# Altium project X_Drive.PrjPcb
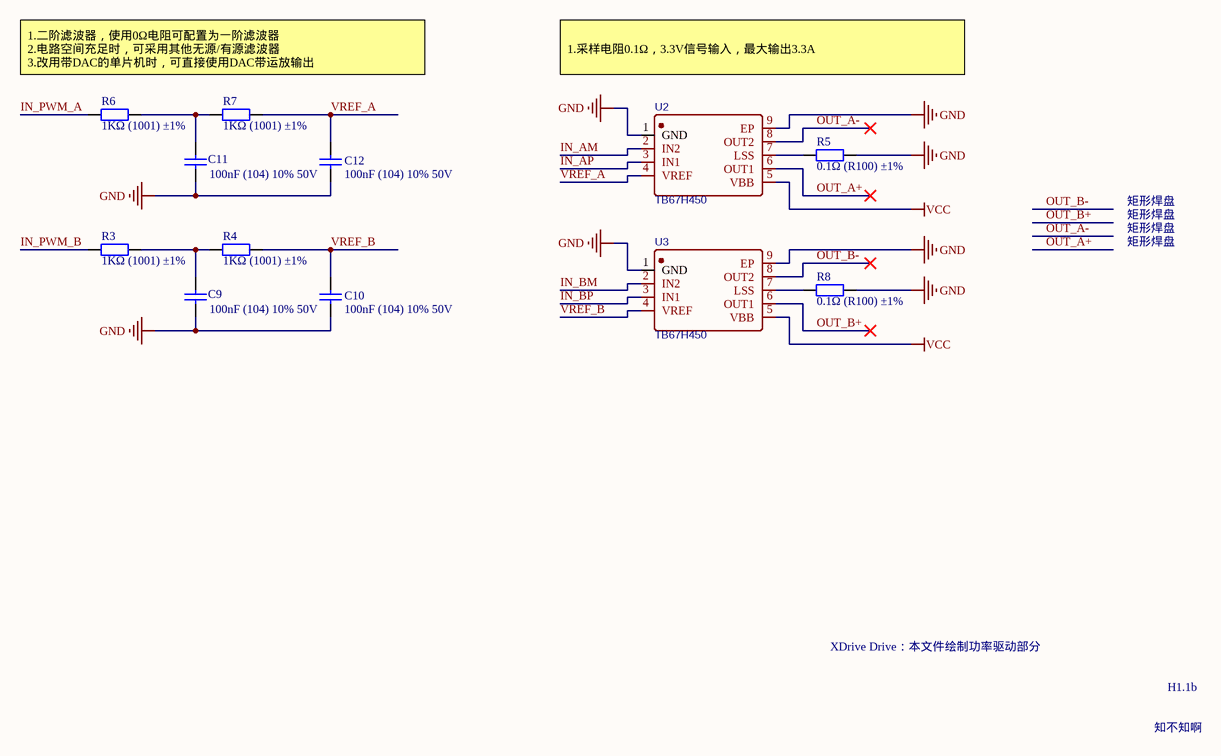
[diagram p0: Drive.SchDoc]
6 sheets, 102 parts. Net scope: global (net labels, ports and power ports of the same name join across sheets).
Board files: PCB.PcbDoc, PCB - 焊接图.PcbDoc
Sheets:
  Drive.SchDoc
  MCU.SchDoc
  Port.SchDoc
  Power.SchDoc
  Sensor.SchDoc
  UI.SchDoc

## Sheet Drive.SchDoc
size A4

### Parts
C9  100nF (104) 10% 50V  [0603_C]
C10  100nF (104) 10% 50V  [0603_C]
C11  100nF (104) 10% 50V  [0603_C]
C12  100nF (104) 10% 50V  [0603_C]
R3  1KΩ (1001) ±1%  [0603_R]
R4  1KΩ (1001) ±1%  [0603_R]
R5  0.1Ω (R100) ±1%  [1206_R]
R6  1KΩ (1001) ±1%  [0603_R]
R7  1KΩ (1001) ±1%  [0603_R]
R8  0.1Ω (R100) ±1%  [1206_R]
U2  TB67H450  [SOIC-8_EP_150MIL]
U3  TB67H450  [SOIC-8_EP_150MIL]

### Nets
GND: C9.1 C10.1 C11.1 C12.1 R5.2 R8.2 U2.1(GND) U2.9(EP) U3.1(GND) U3.9(EP)
VCC: U2.5(VBB) U3.5(VBB)
IN_AM: U2.2(IN2)
IN_AP: U2.3(IN1)
IN_BM: U3.2(IN2)
IN_BP: U3.3(IN1)
IN_PWM_A: R6.1
IN_PWM_B: R3.1
OUT_A+: U2.6(OUT1)
OUT_A-: U2.8(OUT2)
OUT_B+: U3.6(OUT1)
OUT_B-: U3.8(OUT2)
VREF_A: C12.2 R7.2 U2.4(VREF)
VREF_B: C10.2 R4.2 U3.4(VREF)
NetC9_2: C9.2 R3.2 R4.1
NetC11_2: C11.2 R6.2 R7.1
NetR5_1: R5.1 U2.7(LSS)
NetR8_1: R8.1 U3.7(LSS)

### Notes on the sheet
- 1.二阶滤波器，使用0Ω电阻可配置为一阶滤波器
  2.电路空间充足时，可采用其他无源/有源滤波器
  3.改用带DAC的单片机时，可直接使用DAC带运放输出
- 1.采样电阻0.1Ω，3.3V信号输入，最大输出3.3A
- 矩形焊盘
- XDrive Drive：本文件绘制功率驱动部分
- H1.1b
- 知不知啊

### Library data of the parts
C9-C12 = 0603 100nF (104) 10% 50V: 贴片电容; ComponentLink1Description: 供应商链接; ComponentLink1URL: http://www.szlcsc.com/product/details_15331.html; Package: 0603; Supplier: LC; SuppliersPartNumber: C14663
R3 R4 R6 R7 = 0603 1KΩ (1001) 1%: 贴片电阻; ComponentLink1Description: 供应商链接; ComponentLink1URL: http://www.szlcsc.com/product/details_21904.html; Package: 0603; Supplier: LC; SuppliersPartNumber: C21190
R5 R8 = 1206 0.1Ω (R100) 1%: 贴片电阻; ComponentLink1Description: 供应商链接; ComponentLink1URL: http://www.szlcsc.com/product/details_26077.html; Package: 1206; Supplier: LC; SuppliersPartNumber: C25334
U2 U3 = A4950ELJTR-T: 直流电机驱动器; BOM_Manufacturer: ALLEGRO; SMT Type: Extend; BOM_Supplier: LCSC; BOM_Manufacturer Part: A4950ELJTR-T; BOM_Supplier Part: C82404; BOM_LCSC Assembly: Yes; spicePre: U; spiceSymbolName: A4950ELJTR-T

## Sheet MCU.SchDoc
size A4
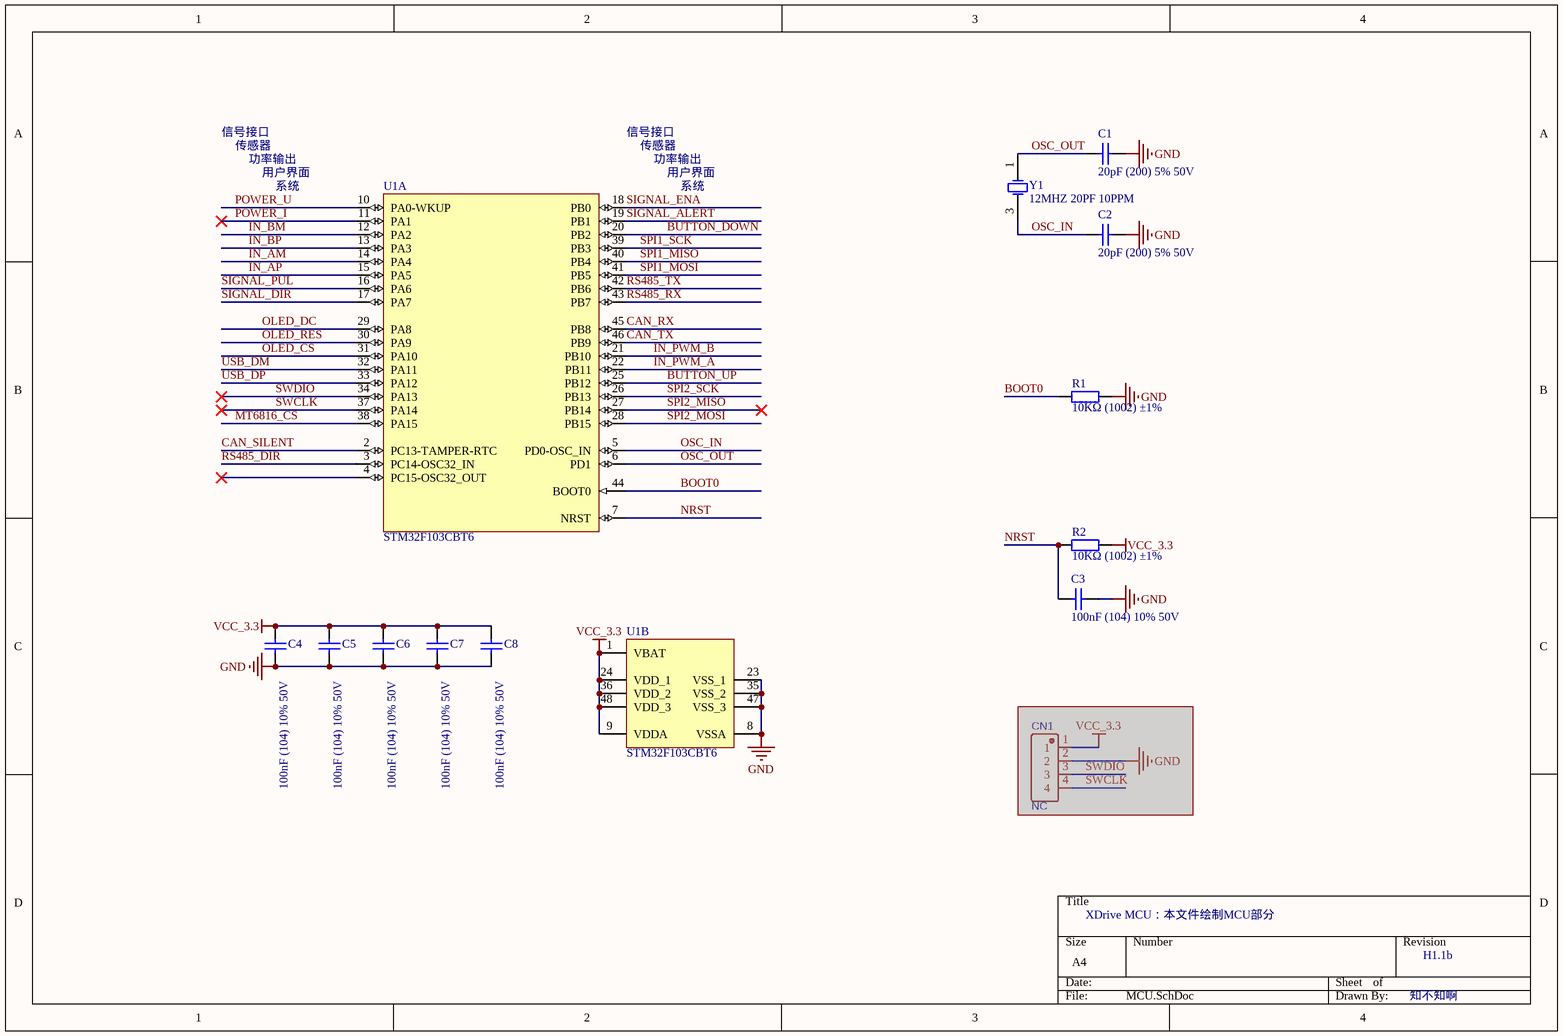
[diagram p1: MCU.SchDoc]

### Parts
(Parts that share a designator on the sheet are numbered #1, #2 ... from top to bottom, then left to right.)
C1  20pF (200) 5% 50V  [0603_C]
C2  20pF (200) 5% 50V  [0603_C]
C3  100nF (104) 10% 50V  [0603_C]
C4  100nF (104) 10% 50V  [0603_C]
C5  100nF (104) 10% 50V  [0603_C]
C6  100nF (104) 10% 50V  [0603_C]
C7  100nF (104) 10% 50V  [0603_C]
C8  100nF (104) 10% 50V  [0603_C]
CN1#1  NC  [HDR2.54-LI-4P]  (masked out: inside a compile mask, not in the netlist)
R1  10KΩ (1002) ±1%  [0603_R]
R2  10KΩ (1002) ±1%  [0603_R]
U1  STM32F103CBT6  [LQFP48_N]  (parts A,B of 2)
Y1  12MHZ 20PF 10PPM  [SMD-3225_4P]

### Nets
GND: C1.1 C2.1 C3.2 C4.1 C5.1 C6.1 C7.1 C8.1 R1.2 U1.8(VSSA) U1.23(VSS_1) U1.35(VSS_2) U1.47(VSS_3)
VCC_3.3: C4.2 C5.2 C6.2 C7.2 C8.2 R2.2 U1.1(VBAT) U1.9(VDDA) U1.24(VDD_1) U1.36(VDD_2) U1.48(VDD_3)
BOOT0: R1.1 U1.44(BOOT0)
BUTTON_DOWN: U1.20(PB2)
BUTTON_UP: U1.25(PB12)
CAN_RX: U1.45(PB8)
CAN_SILENT: U1.2(PC13-TAMPER-RTC)
CAN_TX: U1.46(PB9)
IN_AM: U1.14(PA4)
IN_AP: U1.15(PA5)
IN_BM: U1.12(PA2)
IN_BP: U1.13(PA3)
IN_PWM_A: U1.22(PB11)
IN_PWM_B: U1.21(PB10)
MT6816_CS: U1.38(PA15)
NRST: C3.1 R2.1 U1.7(NRST)
OLED_CS: U1.31(PA10)
OLED_DC: U1.29(PA8)
OLED_RES: U1.30(PA9)
OSC_IN: C2.2 U1.5(PD0-OSC_IN) Y1.3(OSC2)
OSC_OUT: C1.2 U1.6(PD1) Y1.1(OSC1)
POWER_I: U1.11(PA1)
POWER_U: U1.10(PA0-WKUP)
RS485_DIR: U1.3(PC14-OSC32_IN)
RS485_RX: U1.43(PB7)
RS485_TX: U1.42(PB6)
SIGNAL_ALERT: U1.19(PB1)
SIGNAL_DIR: U1.17(PA7)
SIGNAL_ENA: U1.18(PB0)
SIGNAL_PUL: U1.16(PA6)
SPI1_MISO: U1.40(PB4)
SPI1_MOSI: U1.41(PB5)
SPI1_SCK: U1.39(PB3)
SPI2_MISO: U1.27(PB14)
SPI2_MOSI: U1.28(PB15)
SPI2_SCK: U1.26(PB13)
SWCLK: U1.37(PA14)
SWDIO: U1.34(PA13)
USB_DM: U1.32(PA11)
USB_DP: U1.33(PA12)

Not connected (* = marked no-connect by the designer): U1 4(PC15-OSC32_OUT)*

### Notes on the sheet
- 信号接口
- 传感器
- 功率输出
- 用户界面
- 系统
- XDrive MCU：本文件绘制MCU部分
- H1.1b
- 知不知啊

### Library data of the parts
C1 C2 = 0603 20pF (200) 5% 50V: 贴片电容; ComponentLink1Description: 供应商链接; ComponentLink1URL: http://www.szlcsc.com/product/details_2000.html; Package: 0603; Supplier: LC; SuppliersPartNumber: C1648
C3-C8 = 0603 100nF (104) 10% 50V: 贴片电容; ComponentLink1Description: 供应商链接; ComponentLink1URL: http://www.szlcsc.com/product/details_15331.html; Package: 0603; Supplier: LC; SuppliersPartNumber: C14663
CN1#1 = A2005HWV-4P: 单排插针-2.54mm; BOM_Manufacturer: Changjiang Connectors; Contributor: LCSC; BOM_Supplier: LCSC; BOM_Supplier Part: C225282; BOM_Manufacturer Part: A2005HWV-4P; spicePre: C; spiceSymbolName: A2005HWV-4P
R1 R2 = 0603 10KΩ (1002) 1%: 贴片电阻; ComponentLink1Description: 供应商链接; ComponentLink1URL: http://www.szlcsc.com/product/details_26547.html; Package: 0603; Supplier: LC; SuppliersPartNumber: C25804
U1 = STM32F103CBT6: STM32 ARM-based 32-bit MCU Performance Line with 128 kB Flash, 20 kB Internal RAM, -40 to +85癈 Temperature, 48-Pin LQFP, Tray; DatasheetVersion: rev13.0, Apr-2011; PackageVersion: rev13, Apr-2011; PackageReference: LQFP48; PackageDescription: 48-Pin Low-Profile Quad Flat Pack, 7 x 7 mm Body, 0.5 mm Pitch (LQFP48); ComponentLink1Description: Manufacturer URL; ComponentLink1URL: http://www.st.com/; ComponentLink2Description: STM32F103 Datasheet; ComponentLink2URL: http://www.st.com/internet/com/TECHNICAL_RESOURCES/TECHNICAL_LITERATURE/DATASHEET/CD00161566.pdf; ComponentLink3Description: STM32 Family Web Page; ComponentLink3URL: www.st.com/stm32
Y1 = SMD-3225_4P  12MHZ 20PF 10PPM: 贴片晶振; ComponentLink1Description: 供应商链接; ComponentLink1URL: http://www.szlcsc.com/product/details_9522.html; Package: SMD-3225_4P; Supplier: LC; SuppliersPartNumber: C9002

## Sheet Port.SchDoc
size A4
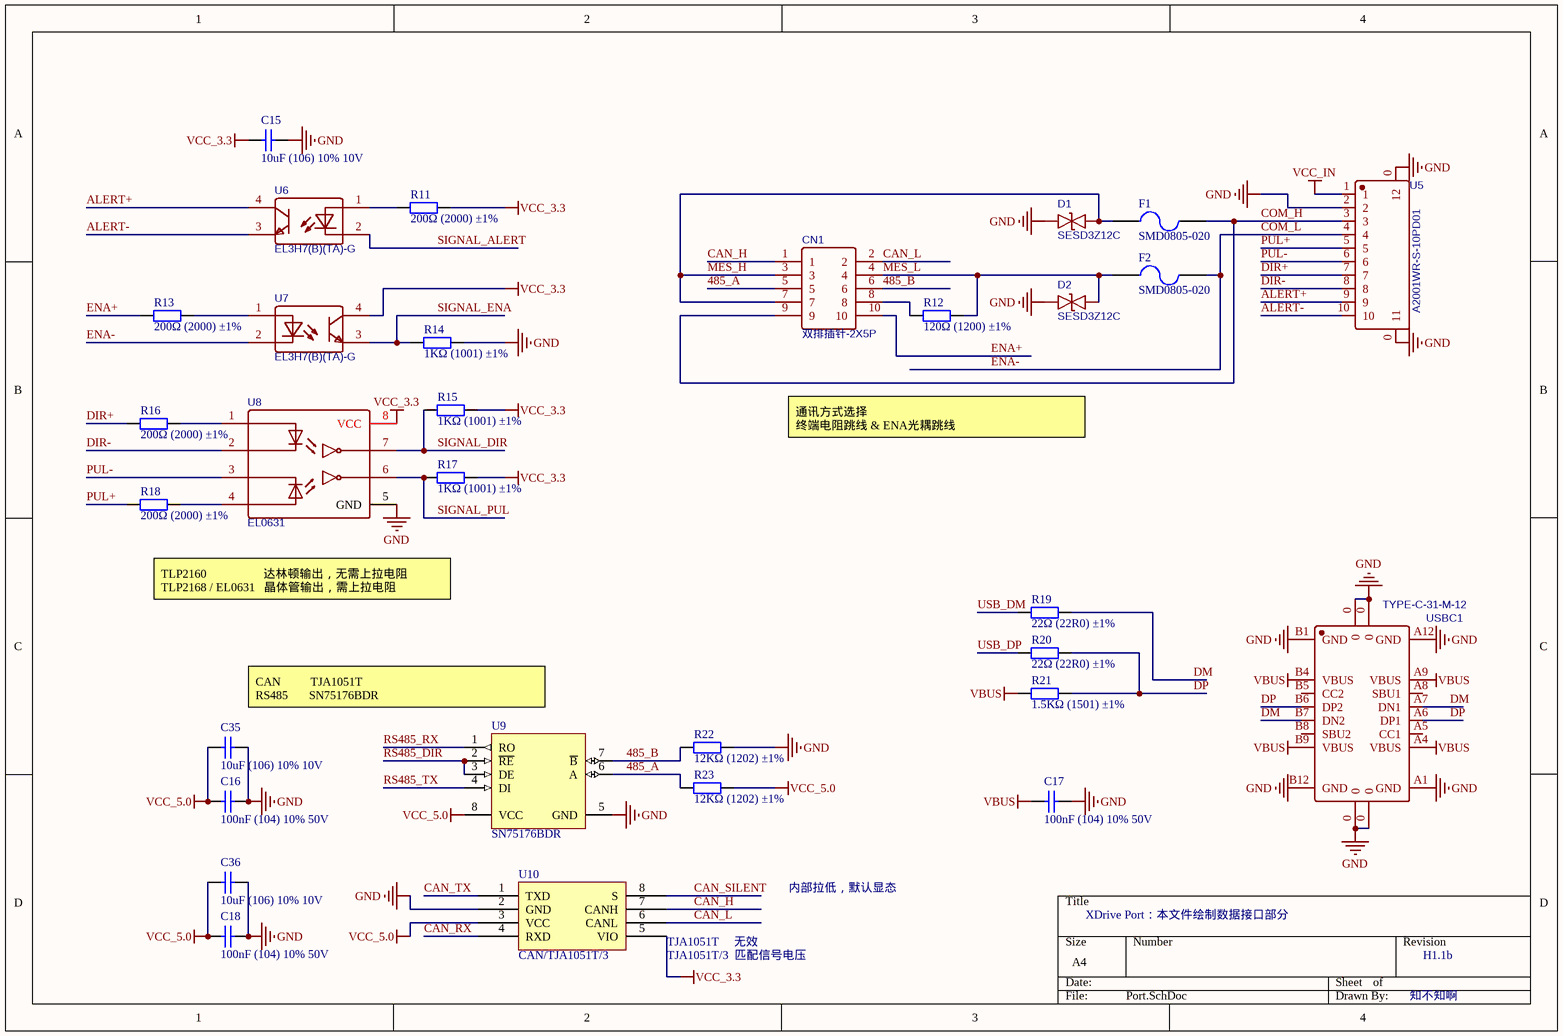
[diagram p2: Port.SchDoc]

### Parts
(Parts that share a designator on the sheet are numbered #1, #2 ... from top to bottom, then left to right.)
C15  10uF (106) 10% 10V  [0603_C]
C16  100nF (104) 10% 50V  [0603_C]
C17  100nF (104) 10% 50V  [0603_C]
C18  100nF (104) 10% 50V  [0603_C]
C35  10uF (106) 10% 10V  [0603_C]
C36  10uF (106) 10% 10V  [0603_C]
CN1#2  双排插针-2X5P  [A2005WV-2X5P]
D1  SESD3Z12C  [SOD-323]
D2  SESD3Z12C  [SOD-323]
F1  SMD0805-020  [FU 0805]
F2  SMD0805-020  [FU 0805]
R11  200Ω (2000) ±1%  [0603_R]
R12  120Ω (1200) ±1%  [0805_R]
R13  200Ω (2000) ±1%  [0603_R]
R14  1KΩ (1001) ±1%  [0603_R]
R15  1KΩ (1001) ±1%  [0603_R]
R16  200Ω (2000) ±1%  [0603_R]
R17  1KΩ (1001) ±1%  [0603_R]
R18  200Ω (2000) ±1%  [0603_R]
R19  22Ω (22R0) ±1%  [0603_R]
R20  22Ω (22R0) ±1%  [0603_R]
R21  1.5KΩ (1501) ±1%  [0603_R]
R22  12KΩ (1202) ±1%  [0603_R]
R23  12KΩ (1202) ±1%  [0603_R]
U5  A2001WR-S-10PD01  [PH2.0-WS-10P]
U6  EL3H7(B)(TA)-G  [SOP4]
U7  EL3H7(B)(TA)-G  [SOP4]
U8  EL0631  [SOIC-8_L5.0-W4.0-P1.27-LS6.0-BL]
U9  SN75176BDR  [SOIC_8]
U10  CAN/TJA1051T/3  [SOIC_8]
USBC1  TYPE-C-31-M-12  [USB-C_SMD-TYPE-C-31-M-12]

### Nets
GND: C15.2 C16.2 C17.2 C18.2 C35.1 C36.1 D1.1 D2.1 R14.1 R22.2 U5.0(11) U5.2 U8.5(GND) U9.5(GND) U10.2(GND) USBC1.0 USBC1.A1(GND) USBC1.A12(GND) USBC1.B1(GND) USBC1.B12(GND)
VBUS: C17.1 R21.1 USBC1.A4(VBUS) USBC1.A9(VBUS) USBC1.B4(VBUS) USBC1.B9(VBUS)
VCC_3.3: C15.1 R11.2 R15.1 R17.1 U7.4(COL) U8.8(VCC) U10.5(VIO)
VCC_5.0: C16.1 C18.1 C35.2 C36.2 R23.2 U9.8(VCC) U10.3(VCC)
VCC_IN: U5.1
485_A: CN1#2.5 R23.1 U9.6(A)
485_B: CN1#2.6 R22.1 U9.7(~{B})
ALERT+: U5.9 U6.4(COL)
ALERT-: U5.10 U6.3(EM)
CAN_H: CN1#2.1 U10.7(CANH)
CAN_L: CN1#2.2 U10.6(CANL)
CAN_RX: U10.4(RXD)
CAN_SILENT: U10.8(S)
CAN_TX: U10.1(TXD)
COM_H: CN1#2.9 F1.2 U5.3
COM_L: F2.2 U5.4 U7.2(CA)  [also labelled ENA-]
DIR+: R16.1 U5.7
DIR-: U5.8 U8.2(CAT1)
DM: R19.2 USBC1.A7(DN1) USBC1.B7(DN2)
DP: R20.2 R21.2 USBC1.A6(DP1) USBC1.B6(DP2)
ENA+: CN1#2.10 R13.1
MES_H: CN1#2.3 CN1#2.7 D1.2 F1.1
MES_L: CN1#2.4 D2.2 F2.1 R12.1
PUL+: R18.1 U5.5
PUL-: U5.6 U8.3(CAT2)
RS485_DIR: U9.2(~{RE}) U9.3(DE)
RS485_RX: U9.1(RO)
RS485_TX: U9.4(DI)
SIGNAL_ALERT: U6.2(CA)
SIGNAL_DIR: R15.2 U8.7(VO1)
SIGNAL_ENA: R14.2 U7.3(EM)
SIGNAL_PUL: R17.2 U8.6(VO2)
USB_DM: R19.1
USB_DP: R20.1
NetCN1#2_8: CN1#2.8 R12.2
NetR11_1: R11.1 U6.1(AN)
NetR13_2: R13.2 U7.1(AN)
NetR16_2: R16.2 U8.1(AN1)
NetR18_2: R18.2 U8.4(AN2)

Not connected (* = marked no-connect by the designer): USBC1 A5(CC1) A8(SBU1) B5(CC2) B8(SBU2)

### Notes on the sheet
- 通讯方式选择
  终端电阻跳线 & ENA光耦跳线
- TLP2160                   达林顿输出，无需上拉电阻
  TLP2168 / EL0631   晶体管输出，需上拉电阻
- CAN          TJA1051T
  RS485       SN75176BDR
- 内部拉低，默认显态
- XDrive Port：本文件绘制数据接口部分
- (near U10) TJA1051T     无效
- (near U10) TJA1051T/3  匹配信号电压
- H1.1b
- 知不知啊

### Library data of the parts
C15 C35 C36 = 0603 10uF (106) 10% 10V: 贴片电容; ComponentLink1Description: 供应商链接; ComponentLink1URL: http://www.szlcsc.com/product/details_20411.html; Package: 0603; Supplier: LC; SuppliersPartNumber: C19702
C16-C18 = 0603 100nF (104) 10% 50V: 贴片电容; ComponentLink1Description: 供应商链接; ComponentLink1URL: http://www.szlcsc.com/product/details_15331.html; Package: 0603; Supplier: LC; SuppliersPartNumber: C14663
CN1#2 = A2005WV-2X5P: 双排插针-2.0mm; BOM_Manufacturer: Changjiang Connectors; Contributor: LCSC; BOM_Supplier: LCSC; BOM_Supplier Part: C225290; BOM_Manufacturer Part: A2005WV-2x5P; spicePre: C; spiceSymbolName: A2005WV-2X5P
D1 D2 = SESD3Z12C: 双向ESD; BOM_Manufacturer: SINO-IC; Contributor: LCSC; BOM_Supplier: LCSC; BOM_Supplier Part: C355241; BOM_Manufacturer Part: SESD3Z12C; spicePre: D; spiceSymbolName: SESD3Z12C
F1 F2 = Fuse 2: 自恢复保险丝 200mA; Published: 8-Jun-2000; LatestRevisionDate: 17-Jul-2002; LatestRevisionNote: Re-released for DXP Platform.; PackageReference: PIN-W2/E2.8; Publisher: Altium Limited; PackageDescription: Thru-Hole; 2 Leads
R11 R13 R16 R18 = 0603 200Ω (2000) 1%: 贴片电阻; ComponentLink1Description: 供应商链接; ComponentLink1URL: http://www.szlcsc.com/product/details_8708.html; Package: 0603; Supplier: LC; SuppliersPartNumber: C8218
R12 = 0805 120Ω (1200) 1%: 贴片电阻; ComponentLink1Description: 供应商链接; ComponentLink1URL: http://www.szlcsc.com/product/details_18125.html; Package: 0805; Supplier: LC; SuppliersPartNumber: C17437
R14 R15 R17 = 0603 1KΩ (1001) 1%: 贴片电阻; ComponentLink1Description: 供应商链接; ComponentLink1URL: http://www.szlcsc.com/product/details_21904.html; Package: 0603; Supplier: LC; SuppliersPartNumber: C21190
R19 R20 = 0603 22Ω (22R0) 1%: 贴片电阻; ComponentLink1Description: 供应商链接; ComponentLink1URL: http://www.szlcsc.com/product/details_24078.html; Package: 0603; Supplier: LC; SuppliersPartNumber: C23345
R21 = 0603 1.5KΩ (1501) 1%: 贴片电阻; ComponentLink1Description: 供应商链接; ComponentLink1URL: http://www.szlcsc.com/product/details_23570.html; Package: 0603; Supplier: LC; SuppliersPartNumber: C22843
R22 R23 = 0603 12KΩ (1202) 1%: 贴片电阻; ComponentLink1Description: 供应商链接; ComponentLink1URL: http://www.szlcsc.com/product/details_23517.html; Package: 0603; Supplier: LC; SuppliersPartNumber: C22790
U5 = A2001WR-S-10PD01: 贴片PH2.0插座; BOM_Manufacturer: HR; Contributor: LCSC; BOM_Supplier: LCSC; BOM_Supplier Part: C278796; BOM_Manufacturer Part: A2001WR-S-10PD01; spicePre: U
U6 U7 = EL357N(A)(TA)-G: 光耦; BOM_Manufacturer: EVERLIGHT; Contributor: LCSC; SMT Type: Extend; BOM_Supplier: LCSC; BOM_Manufacturer Part: EL357N(A)(TA)-G; BOM_Supplier Part: C142286; BOM_LCSC Assembly: Yes; spicePre: U; spiceSymbolName: EL357N(A)(TA)-G
U8 = TLP2160(TP,F): 光耦; BOM_Manufacturer: TOSHIBA; Contributor: LCSC; BOM_Supplier: LCSC; BOM_Supplier Part: C393887; BOM_Manufacturer Part: TLP2160(TP,F); spicePre: U; spiceSymbolName: TLP2160(TP,F)
U9 = SN75176BDR_[C7063]: RS-485/RS-422; ComponentLink1Description: 供应商链接; ComponentLink1URL: http://www.szlcsc.com/product/details_7535.html; Package: SOIC-8_150mil; Supplier: LC; SuppliersPartNumber: C7063
U10 = CAN/TJA1051T/3_[C38695]: CAN; ComponentLink1Description: 供应商链接; ComponentLink1URL: http://www.szlcsc.com/product/details_39678.html; Package: SOIC-8_150mil; Supplier: LC; SuppliersPartNumber: C38695
USBC1 = TYPE-C-31-M-12: TYPE-C USB插座; BOM_Manufacturer: Rectangular Connectors - Contacts; Contributor: LCSC; BOM_Supplier: LCSC; BOM_Supplier Part: C165948; BOM_Manufacturer Part: TYPE-C-31-M-12; spicePre: U; spiceSymbolName: TYPE-C-31-M-12

## Sheet Power.SchDoc
size A4
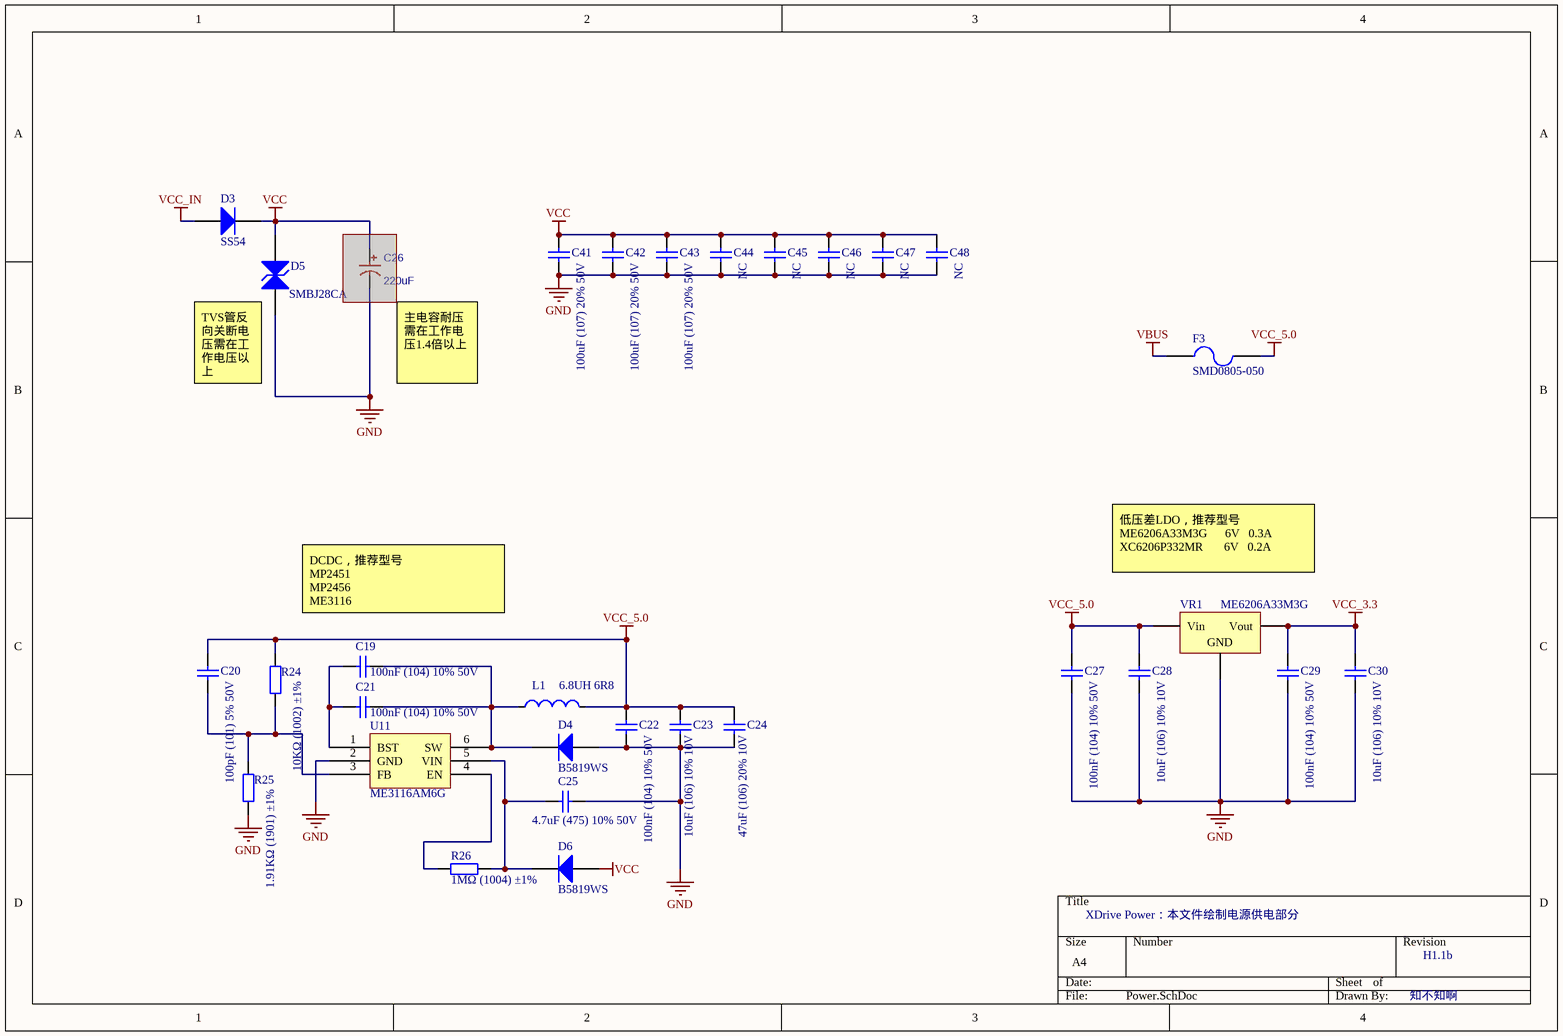
[diagram p3: Power.SchDoc]

### Parts
C19  100nF (104) 10% 50V  [0603_C]
C20  100pF (101) 5% 50V  [0603_C]
C21  100nF (104) 10% 50V  [0603_C]
C22  100nF (104) 10% 50V  [0603_C]
C23  10uF (106) 10% 10V  [0603_C]
C24  47uF (106) 20% 10V  [1206_C]
C25  4.7uF (475) 10% 50V  [1206_C]
C26  220uF  [CAP 3.5*8*11.5 - GD]  (masked out: inside a compile mask, not in the netlist)
C27  100nF (104) 10% 50V  [0603_C]
C28  10uF (106) 10% 10V  [0603_C]
C29  100nF (104) 10% 50V  [0603_C]
C30  10uF (106) 10% 10V  [0603_C]
C41  100uF (107) 20% 50V  [C 1210_L]
C42  100uF (107) 20% 50V  [C 1210_L]
C43  100uF (107) 20% 50V  [C 1210_L]
C44  NC  [C 1210_L]
C45  NC  [C 1210_L]
C46  NC  [C 1210_L]
C47  NC  [C 1210_L]
C48  NC  [C 1210_L]
D3  SS54  [SMB]
D4  B5819WS  [SOD-323]
D5  SMBJ28CA  [SMB]
D6  B5819WS  [SOD-323]
F3  SMD0805-050  [FU 0805]
L1  6.8UH 6R8  [L 1206]
R24  10KΩ (1002) ±1%  [0603_R]
R25  1.91KΩ (1901) ±1%  [0603_R]
R26  1MΩ (1004) ±1%  [0603_R]
U11  ME3116AM6G  [SOT-23-6]
VR1  ME6206A33M3G  [SOT-23-3L]

### Nets
GND: C22.1 C23.1 C24.1 C25.2 C27.1 C28.1 C29.1 C30.1 C41.1 C42.1 C43.1 C44.1 C45.1 C46.1 C47.1 C48.1 D4.1(A) D5.1(A) R25.1 U11.2(GND) VR1.1(GND)
VBUS: F3.1
VCC: C41.2 C42.2 C43.2 C44.2 C45.2 C46.2 C47.2 C48.2 D3.2(K) D5.2(K) D6.1(A)
VCC_3.3: C29.2 C30.2 VR1.2(Vout)
VCC_5.0: C20.1 C22.2 C23.2 C24.2 C27.2 C28.2 F3.2 L1.2 R24.2 VR1.3(Vin)
VCC_IN: D3.1(A)
NetC19_1: C19.1 C21.1 U11.1(BST)
NetC19_2: C19.2 C21.2 D4.2(K) L1.1 U11.6(SW)
NetC20_2: C20.2 R24.1 R25.2 U11.3(FB)
NetC25_1: C25.1 D6.2(K) R26.1 U11.5(VIN)
NetR26_2: R26.2 U11.4(EN)

### Notes on the sheet
- (near D5) TVS管反向关断电压需在工作电压以上
- (near C26) 主电容耐压需在工作电压1.4倍以上
- 低压差LDO，推荐型号
  ME6206A33M3G      6V   0.3A
  XC6206P332MR       6V   0.2A
- DCDC，推荐型号
  MP2451
  MP2456
  ME3116
- XDrive Power：本文件绘制电源供电部分
- H1.1b
- 知不知啊

### Library data of the parts
C19 C21 C22 C27 C29 = 0603 100nF (104) 10% 50V: 贴片电容; ComponentLink1Description: 供应商链接; ComponentLink1URL: http://www.szlcsc.com/product/details_15331.html; Package: 0603; Supplier: LC; SuppliersPartNumber: C14663
C20 = 0603 100pF (101) 5% 50V: 贴片电容; ComponentLink1Description: 供应商链接; ComponentLink1URL: http://www.szlcsc.com/product/details_15530.html; Package: 0603; Supplier: LC; SuppliersPartNumber: C14858
C23 C28 C30 = 0603 10uF (106) 10% 10V: 贴片电容; ComponentLink1Description: 供应商链接; ComponentLink1URL: http://www.szlcsc.com/product/details_20411.html; Package: 0603; Supplier: LC; SuppliersPartNumber: C19702
C24 = 1206 10uF (106) 10% 50V: 贴片电容; ComponentLink1Description: 供应商链接; ComponentLink1URL: http://www.szlcsc.com/product/details_14236.html; Package: 1206; Supplier: LC; SuppliersPartNumber: C13585
C25 = 1206 4.7uF (475) 10% 50V: 贴片电容; ComponentLink1Description: 供应商链接; ComponentLink1URL: http://www.szlcsc.com/product/details_30577.html; Package: 1206; Supplier: LC; SuppliersPartNumber: C29823
C26 = CAP_SMD,8x10.2mm: 直插电解电容; BOM_Manufacturer: ROQANG; BOM_Manufacturer Part: RVT1A471M0810; nameAlias: Capacitance; BOM_Supplier: LCSC; BOM_Supplier Part: C72516; spicePre: C; spiceSymbolName: RVT1A471M0810
C41-C48 = Cap: 贴片电容; Published: 8-Jun-2000; LatestRevisionDate: 17-Jul-2002; LatestRevisionNote: Re-released for DXP Platform.; PackageReference: RAD-0.3; Publisher: Altium Limited; PackageDescription: Radial Cap, Thru-Hole; 2 Leads; 0.3 in Pin Spacing
D3 = SMA(DO-214AC) SS54: 二极管; ComponentLink1Description: 供应商链接; ComponentLink1URL: http://www.szlcsc.com/product/details_23178.html; Package: SMA(DO-214AC); Supplier: LC; SuppliersPartNumber: C22452
D4 D6 = SOD-323 1N4148WS T4: 二极管; ComponentLink1Description: 供应商链接; ComponentLink1URL: http://www.szlcsc.com/product/details_2485.html; Package: SOD-323; Supplier: LC; SuppliersPartNumber: C2128
D5 = SMB/DO-214AA P6SMB6.8CA: TVS; ComponentLink1Description: 供应商链接; ComponentLink1URL: http://www.szlcsc.com/product/details_79530.html; Package: SMB/DO-214AA; Supplier: LC; SuppliersPartNumber: C78395
F3 = Fuse 2: 自恢复保险丝 500mA; Published: 8-Jun-2000; LatestRevisionDate: 17-Jul-2002; LatestRevisionNote: Re-released for DXP Platform.; PackageReference: PIN-W2/E2.8; Publisher: Altium Limited; PackageDescription: Thru-Hole; 2 Leads
L1 = IND: 贴片电感
R24 = 0603 10KΩ (1002) 1%: 贴片电阻; ComponentLink1Description: 供应商链接; ComponentLink1URL: http://www.szlcsc.com/product/details_26547.html; Package: 0603; Supplier: LC; SuppliersPartNumber: C25804
R25 = 0603 1KΩ (1001) 1%: 贴片电阻; ComponentLink1Description: 供应商链接; ComponentLink1URL: http://www.szlcsc.com/product/details_21904.html; Package: 0603; Supplier: LC; SuppliersPartNumber: C21190
R26 = 0603 1MΩ (1004) 1%: 贴片电阻; ComponentLink1Description: 供应商链接; ComponentLink1URL: http://www.szlcsc.com/product/details_23662.html; Package: 0603; Supplier: LC; SuppliersPartNumber: C22935
U11 = MP2451DT-LF-Z_[C14123]: DC-DC芯片; ComponentLink1Description: 供应商链接; ComponentLink1URL: http://www.szlcsc.com/product/details_14780.html; Package: SOT-23-6; Supplier: LC; SuppliersPartNumber: C14123
VR1 = SOT-23 XC6206P332MR: 低压差线性稳压(LDO); ComponentLink1Description: 供应商链接; ComponentLink1URL: http://www.szlcsc.com/product/details_5896.html; Package: SOT-23; Supplier: LC; SuppliersPartNumber: C5446

## Sheet Sensor.SchDoc
size A4
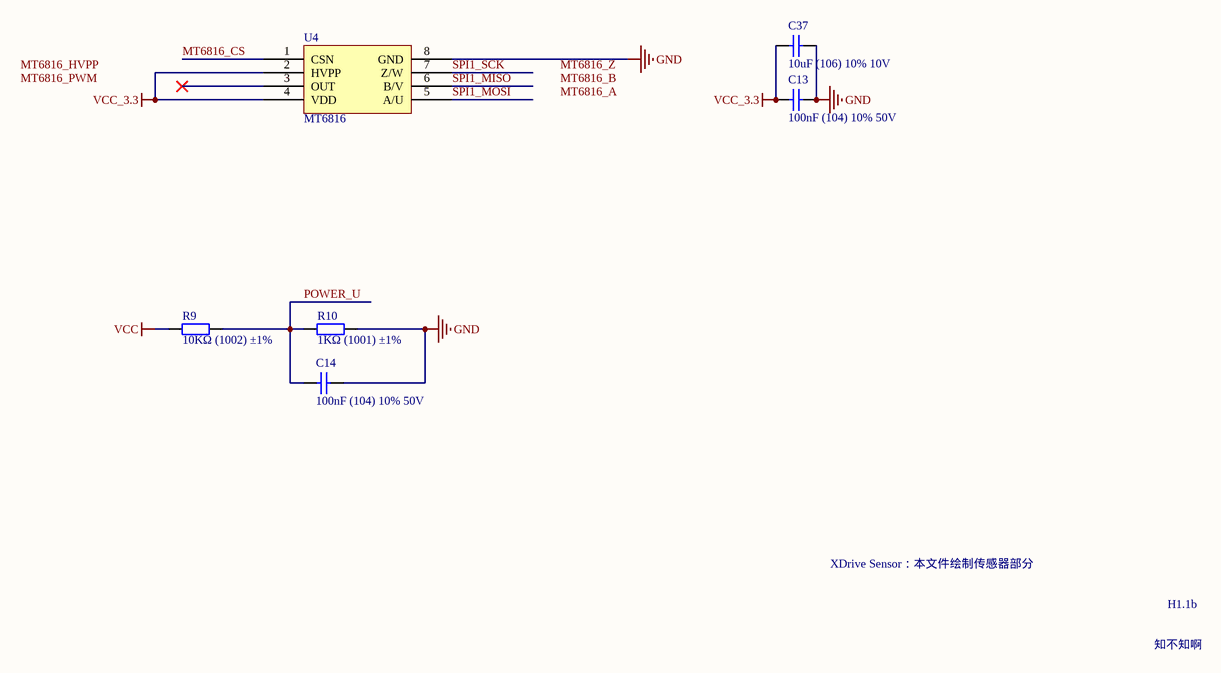
[diagram p4: Sensor.SchDoc]

### Parts
C13  100nF (104) 10% 50V  [0603_C]
C14  100nF (104) 10% 50V  [0603_C]
C37  10uF (106) 10% 10V  [0603_C]
R9  10KΩ (1002) ±1%  [0603_R]
R10  1KΩ (1001) ±1%  [0603_R]
U4  MT6816  [SOIC_8]

### Nets
GND: C13.1 C14.2 C37.1 R10.2 U4.8(GND)
VCC: R9.1
VCC_3.3: C13.2 C37.2 U4.2(HVPP) U4.4(VDD)
MT6816_CS: U4.1(CSN)
POWER_U: C14.1 R9.2 R10.1
SPI1_MISO: U4.6(B/V)
SPI1_MOSI: U4.5(A/U)
SPI1_SCK: U4.7(Z/W)

Not connected (* = marked no-connect by the designer): U4 3(OUT)*

### Notes on the sheet
- XDrive Sensor：本文件绘制传感器部分
- H1.1b
- 知不知啊
- Labels drawn without touching a wire or pin: MT6816_A, MT6816_B, MT6816_HVPP, MT6816_PWM, MT6816_Z

### Library data of the parts
C13 C14 = 0603 100nF (104) 10% 50V: 贴片电容; ComponentLink1Description: 供应商链接; ComponentLink1URL: http://www.szlcsc.com/product/details_15331.html; Package: 0603; Supplier: LC; SuppliersPartNumber: C14663
C37 = 0603 10uF (106) 10% 10V: 贴片电容; ComponentLink1Description: 供应商链接; ComponentLink1URL: http://www.szlcsc.com/product/details_20411.html; Package: 0603; Supplier: LC; SuppliersPartNumber: C19702
R9 = 0603 10KΩ (1002) 1%: 贴片电阻; ComponentLink1Description: 供应商链接; ComponentLink1URL: http://www.szlcsc.com/product/details_26547.html; Package: 0603; Supplier: LC; SuppliersPartNumber: C25804
R10 = 0603 1KΩ (1001) 1%: 贴片电阻; ComponentLink1Description: 供应商链接; ComponentLink1URL: http://www.szlcsc.com/product/details_21904.html; Package: 0603; Supplier: LC; SuppliersPartNumber: C21190
U4 = MT6816: 磁角度传感器

## Sheet UI.SchDoc
size A4
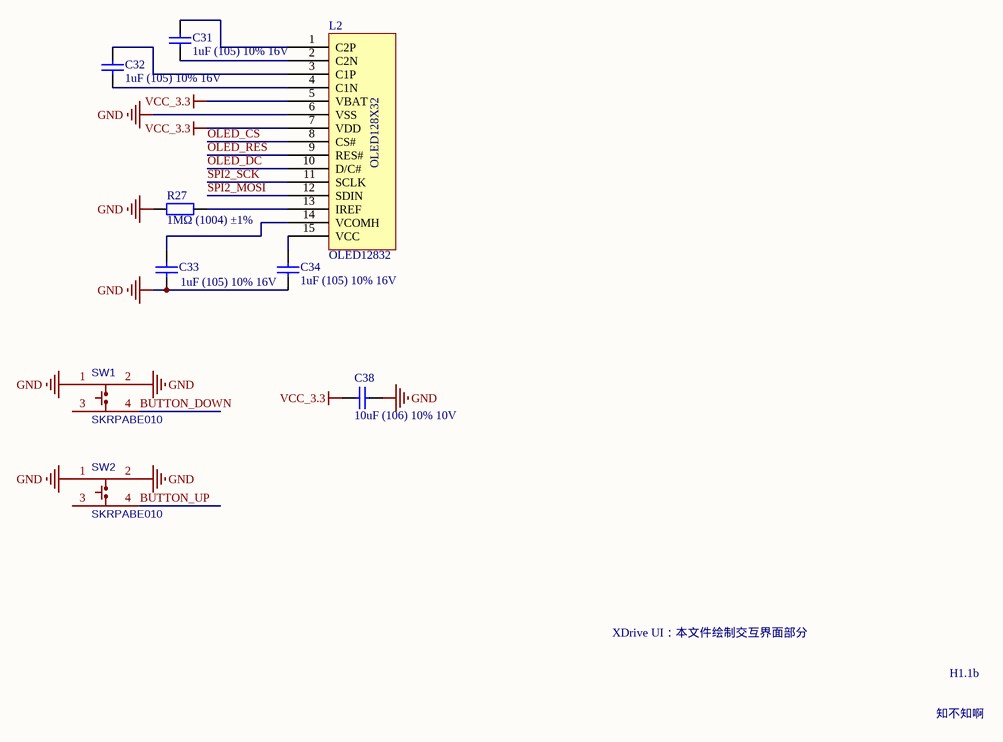
[diagram p5: UI.SchDoc]

### Parts
C31  1uF (105) 10% 16V  [0603_C]
C32  1uF (105) 10% 16V  [0603_C]
C33  1uF (105) 10% 16V  [0603_C]
C34  1uF (105) 10% 16V  [0603_C]
C38  10uF (106) 10% 10V  [0603_C]
L2  OLED12832  [PCBComponent_1 - duplicate]
R27  1MΩ (1004) ±1%  [0603_R]
SW1  SKRPABE010  [KEY-SMD-4P_L4.20-W3.20]
SW2  SKRPABE010  [KEY-SMD-4P_L4.20-W3.20]

### Nets
GND: C33.1 C34.1 C38.1 L2.6(VSS) R27.1 SW1.1 SW1.2 SW2.1 SW2.2
VCC_3.3: C38.2 L2.5(VBAT) L2.7(VDD)
BUTTON_DOWN: SW1.4
BUTTON_UP: SW2.4
OLED_CS: L2.8(CS#)
OLED_DC: L2.10(D/C#)
OLED_RES: L2.9(RES#)
SPI2_MOSI: L2.12(SDIN)
SPI2_SCK: L2.11(SCLK)
NetC31_1: C31.1 L2.2(C2N)
NetC31_2: C31.2 L2.1(C2P)
NetC32_1: C32.1 L2.4(C1N)
NetC32_2: C32.2 L2.3(C1P)
NetC33_2: C33.2 L2.14(VCOMH)
NetC34_2: C34.2 L2.15(VCC)
NetL2_13: L2.13(IREF) R27.2

Not connected (* = marked no-connect by the designer): SW1 3; SW2 3

### Notes on the sheet
- XDrive UI：本文件绘制交互界面部分
- H1.1b
- 知不知啊
- (in symbol OLED12832) OLED128X32

### Library data of the parts
C31-C34 = 0603 1uF (105) 10% 50V: 贴片电容; ComponentLink1Description: 供应商链接; ComponentLink1URL: http://www.szlcsc.com/product/details_16531.html; Package: 0603; Supplier: LC; SuppliersPartNumber: C15849
C38 = 0603 10uF (106) 10% 10V: 贴片电容; ComponentLink1Description: 供应商链接; ComponentLink1URL: http://www.szlcsc.com/product/details_20411.html; Package: 0603; Supplier: LC; SuppliersPartNumber: C19702
R27 = 0603 2MΩ (2004) 1%: 贴片电阻; ComponentLink1Description: 供应商链接; ComponentLink1URL: http://www.szlcsc.com/product/details_23703.html; Package: 0603; Supplier: LC; SuppliersPartNumber: C22976
SW1 SW2 = SKRPABE010: 4脚贴片按键; BOM_Manufacturer: ALPS; BOM_Supplier: LCSC; BOM_Manufacturer Part: SKRPABE010; BOM_Supplier Part: C115360; spicePre: S; spiceSymbolName: SKRPABE010

## Nets that join several sheets
GND: Drive (10 pins), MCU (13 pins), Port (20 pins), Power (21 pins), Sensor (5 pins), UI (9 pins)
VBUS: Port (6 pins), Power (F3.1)
VCC: Drive (U2.5 U3.5), Power (11 pins), Sensor (R9.1)
VCC_3.3: MCU (11 pins), Port (7 pins), Power (C29.2 C30.2 VR1.2), Sensor (C13.2 C37.2 U4.2 U4.4), UI (C38.2 L2.5 L2.7)
VCC_5.0: Port (7 pins), Power (10 pins)
VCC_IN: Port (U5.1), Power (D3.1)
BUTTON_DOWN: MCU (U1.20), UI (SW1.4)
BUTTON_UP: MCU (U1.25), UI (SW2.4)
CAN_RX: MCU (U1.45), Port (U10.4)
CAN_SILENT: MCU (U1.2), Port (U10.8)
CAN_TX: MCU (U1.46), Port (U10.1)
IN_AM: Drive (U2.2), MCU (U1.14)
IN_AP: Drive (U2.3), MCU (U1.15)
IN_BM: Drive (U3.2), MCU (U1.12)
IN_BP: Drive (U3.3), MCU (U1.13)
IN_PWM_A: Drive (R6.1), MCU (U1.22)
IN_PWM_B: Drive (R3.1), MCU (U1.21)
MT6816_CS: MCU (U1.38), Sensor (U4.1)
OLED_CS: MCU (U1.31), UI (L2.8)
OLED_DC: MCU (U1.29), UI (L2.10)
OLED_RES: MCU (U1.30), UI (L2.9)
POWER_U: MCU (U1.10), Sensor (C14.1 R9.2 R10.1)
RS485_DIR: MCU (U1.3), Port (U9.2 U9.3)
RS485_RX: MCU (U1.43), Port (U9.1)
RS485_TX: MCU (U1.42), Port (U9.4)
SIGNAL_ALERT: MCU (U1.19), Port (U6.2)
SIGNAL_DIR: MCU (U1.17), Port (R15.2 U8.7)
SIGNAL_ENA: MCU (U1.18), Port (R14.2 U7.3)
SIGNAL_PUL: MCU (U1.16), Port (R17.2 U8.6)
SPI1_MISO: MCU (U1.40), Sensor (U4.6)
SPI1_MOSI: MCU (U1.41), Sensor (U4.5)
SPI1_SCK: MCU (U1.39), Sensor (U4.7)
SPI2_MOSI: MCU (U1.28), UI (L2.12)
SPI2_SCK: MCU (U1.26), UI (L2.11)
USB_DM: MCU (U1.32), Port (R19.1)
USB_DP: MCU (U1.33), Port (R20.1)